# EAGLE design Joystick (EAGLE 7.1.0)
Assembly variants: standard
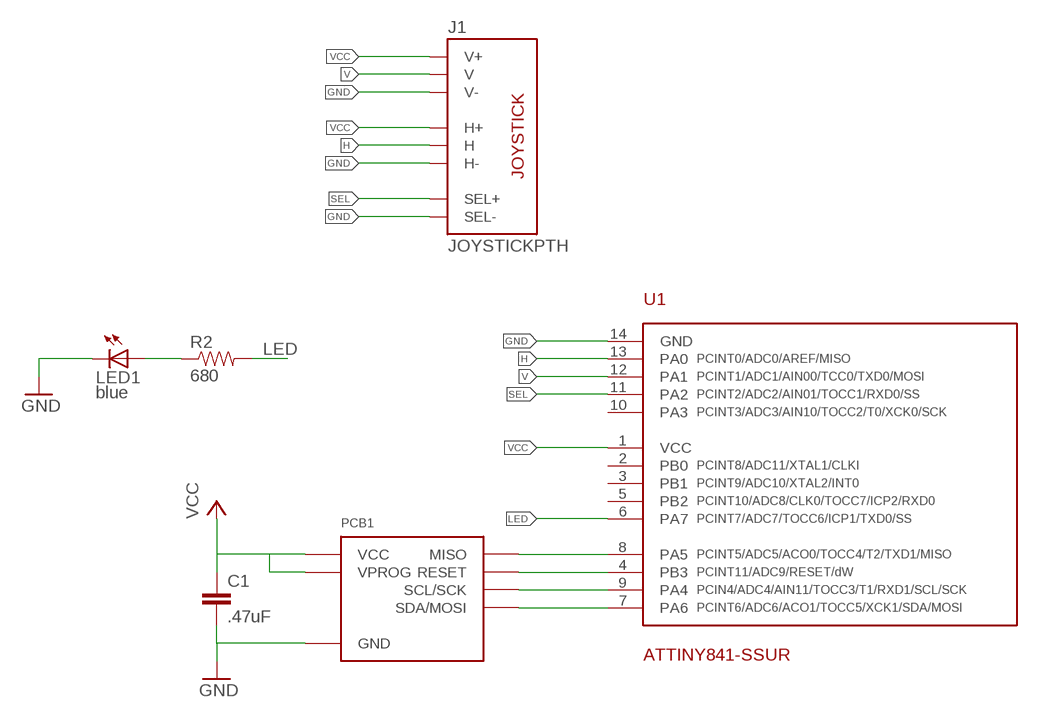
[diagram p0: schematic, sheet 1]

## Parts
C1  .47uF  CAP0805  [0805]
J1  JOYSTICKPTH  [JOYSTICK]
LED1  blue  LED-0805-BLUE  [0805-LED]
PCB1  MAGDEVICE-V2  [MAGDEVICE-V2]
R2  680  RESISTOR0805-RES  [0805]
U1  ATTINY841-SSUR  ATTINY841  [SOIC-14]

## Nets
GND: C1.2 J1.B2A(SEL-) J1.H3(H-) J1.V3(V-) LED1.C PCB1.GND U1.14(GND)
H: J1.H2(H) U1.13(PA0)
LED: R2.2 U1.6(PA7)
N$2: PCB1.MISO U1.8(PA5)
N$3: PCB1.RESET U1.4(PB3)
N$4: PCB1.SCL(SCL/SCK) U1.9(PA4)
N$5: PCB1.SDA(SDA/MOSI) U1.7(PA6)
N$7: LED1.A R2.1
SEL: J1.B1A(SEL+) U1.11(PA2)
V: J1.V2(V) U1.12(PA1)
VCC: C1.1 J1.H1(H+) J1.V1(V+) PCB1.VCC PCB1.VPROG U1.1(VCC)
Unconnected: U1.2(PB0) U1.3(PB1) U1.5(PB2) U1.10(PA3)

## Library data of the parts
C1 = SparkFun-Capacitors:CAP: Capacitor Standard 0603 ceramic capacitor, and 0.1" leaded capacitor.
J1 = Modulo:JOYSTICK: Thumb Joystick Joystick commonly found in PS2 controllers. Two pots and a select switch. Footprint proven. Spark Fun Electronics SKU : COM-09032
LED1 = Modulo:LED: LED; PARTNUM: LTST-C171TBKT
PCB1 = Modulo:MAGDEVICE
R2 = SparkFun-Passives:RESISTOR: Resistor Basic schematic elements and footprints for 0603, 1206, and PTH resistors.
U1 = Modulo:ATTINY841

## Board
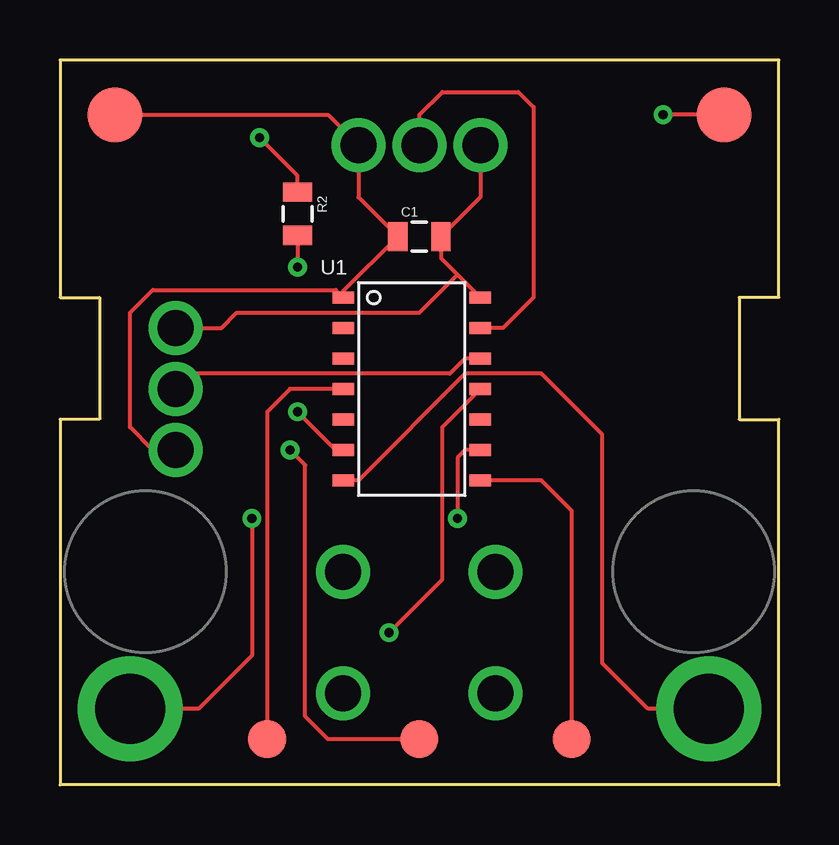
[diagram p1: board, top side]
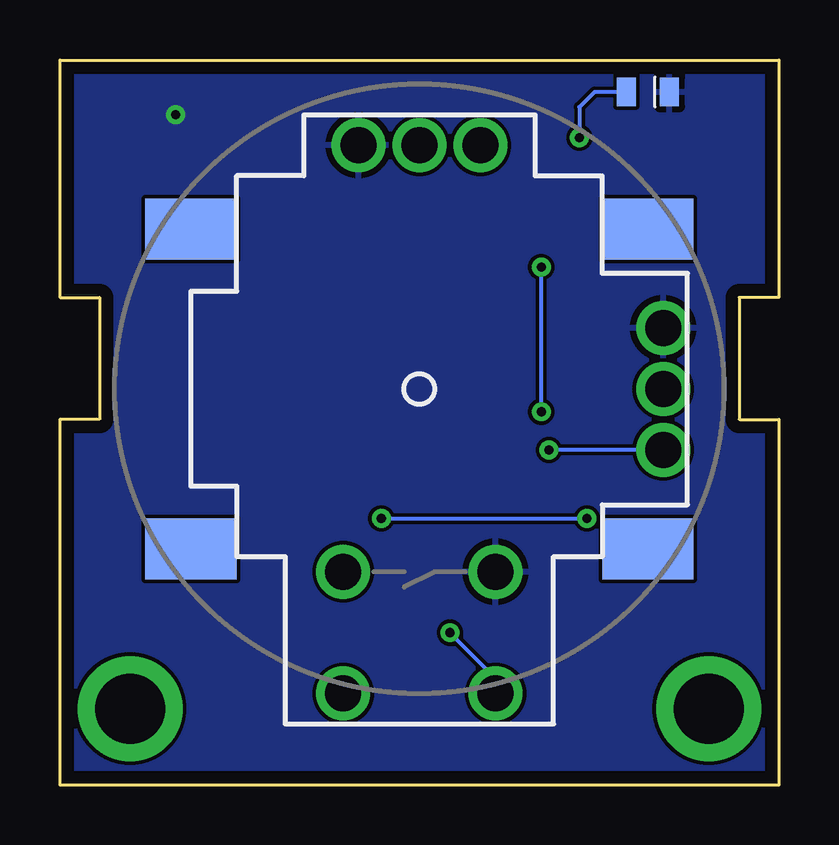
[diagram p2: board, bottom side, seen from below]

Size 29.97 x 30.23 mm. Coordinates in mm from the lower left corner, seen from the top.
Copper layers (1*16): Top 0.0178mm / dielectric 59mil / Bottom 0.0178mm
Design rules "SSC-EAGLE-2Lyr_v1.0.0.3 *": minimum track width 6mil, minimum drill 14mil, track to track 6mil, track to pad 6mil, pad to pad 6mil, via to via 6mil, smd to smd 6mil, copper to edge 20mil, drill to drill 16mil, minimum pad ring 8mil, minimum via ring 8mil, stop-mask expansion 3mil, vias tented up to drill 25mil, thermal gap 10mil

### Footprints (pad centres in the part's own frame; a part is rotated, then mirrored left to right if it is on the bottom)
0805 = smd 0.8 x 1.2: 1 -0.9,0; 2 0.9,0
JOYSTICK = drill 1.5: B1A -3.175,12.7; B1B 3.175,12.7; B2A -3.175,7.62; B2B 3.175,7.62; H1 -2.54,-10.16; H2 0,-10.16; H3 2.54,-10.16; V1 -10.16,2.54; V2 -10.16,0; V3 -10.16,-2.54 | smd 3.81 x 2.54: MOUNT3 9.525,-6.668; MOUNT5 -9.525,-6.668; MOUNT6 9.525,6.668; MOUNT7 -9.525,6.668
0805-LED = smd 1.2 x 0.8: A 0,-0.9; C 0,0.9
MAGDEVICE-V2 = smd 2.286 x 2.286 bottom: GND 2.54,27.94; VCC 27.94,27.94 | smd 1.587 x 1.587 bottom: MISO 8.89,1.905; RESET 21.59,1.905; VPROG 15.24,1.905 | drill 2.921: SCL 27.305,3.175; SDA 3.175,3.175
SOIC-14 = smd 0.508 x 0.889: 1 0,-3.175; 2 1.27,-3.175; 3 2.54,-3.175; 4 3.81,-3.175; 5 5.08,-3.175; 6 6.35,-3.175; 7 7.62,-3.175; 8 7.62,2.54; 9 6.35,2.54; 10 5.08,2.54; 11 3.81,2.54; 12 2.54,2.54; 13 1.27,2.54; 14 0,2.54

### Placement (x,y rotation side)
C1  14.99,22.86 0 top
J1  14.99,16.51 180 bottom
LED1  5.46,28.89 270 bottom
PCB1  30.23,0 0 bottom
R2  9.91,23.81 270 top
U1  14.99,20.32 270 top

### Tracks (layer width: path | path; a pad name or v marks a point on that pad's centre or on a via)
GND  (via drill 0.38)
  Top 0.159: 16.57,21.27 15.89,21.96 C1.2 17.53,24.5 J1.H3 | 16.57,21.27 U1.14 | J1.V3 6.73,19.05 7.37,19.68 14.99,19.68 16.57,21.27 | PCB1.GND v25.15,27.94
  pour Bottom: -0.25,0 30.23,0 30.23,30.48 -0.25,30.48
H
  Top 0.159: J1.H2 14.99,27.94 15.94,28.89 19.11,28.89 19.75,28.26 19.75,20.32 18.48,19.05 U1.13
LED  (via drill 0.38)
  Top 0.159: U1.6 11.49,13.97 v9.91,15.56 | R2.2 v9.91,21.59
  Bottom 0.159: v9.91,15.56 v9.91,21.59
N$2
  Top 0.159: PCB1.MISO 21.34,11.43 20.07,12.7 U1.8
N$3
  Top 0.159: U1.4 9.59,16.51 8.64,15.56 PCB1.RESET
N$4  (via drill 0.38)
  Top 0.159: U1.9 16.89,13.97 16.57,13.65 v16.57,11.11 | v8,11.11 8,5.4 5.78,3.17 PCB1.SCL
  Bottom 0.159: v16.57,11.11 v8,11.11
N$5
  Top 0.159: U1.7 12.45,12.7 16.89,17.14 20.07,17.14 22.61,14.61 22.61,5.08 24.51,3.17 PCB1.SDA
N$7  (via drill 0.38)
  Top 0.159: R2.1 9.91,25.4 v8.32,26.99
  Bottom 0.159: LED1.A 7.68,28.89 8.32,28.26 v8.32,26.99
SEL  (via drill 0.38)
  Top 0.159: v13.72,6.35 15.94,8.57 15.94,14.92 U1.11
  Bottom 0.159: J1.B1A 11.81,4.45 v13.72,6.35
V
  Top 0.159: U1.12 16.89,17.78 16.26,17.14 5.46,17.14 J1.V2
VCC  (via drill 0.38)
  Top 0.159: PCB1.VCC 11.18,27.94 J1.H1 12.45,24.5 C1.1 11.81,20.59 U1.1 11.49,20.64 3.87,20.64 2.92,19.68 2.92,14.92 3.87,13.97 J1.V1 | PCB1.VPROG 11.18,1.91 10.22,2.86 10.22,13.34 v9.59,13.97
  Bottom 0.159: J1.V1 v9.59,13.97